# EAGLE design rgbww32c3wroom02 (EAGLE 7.7.0)
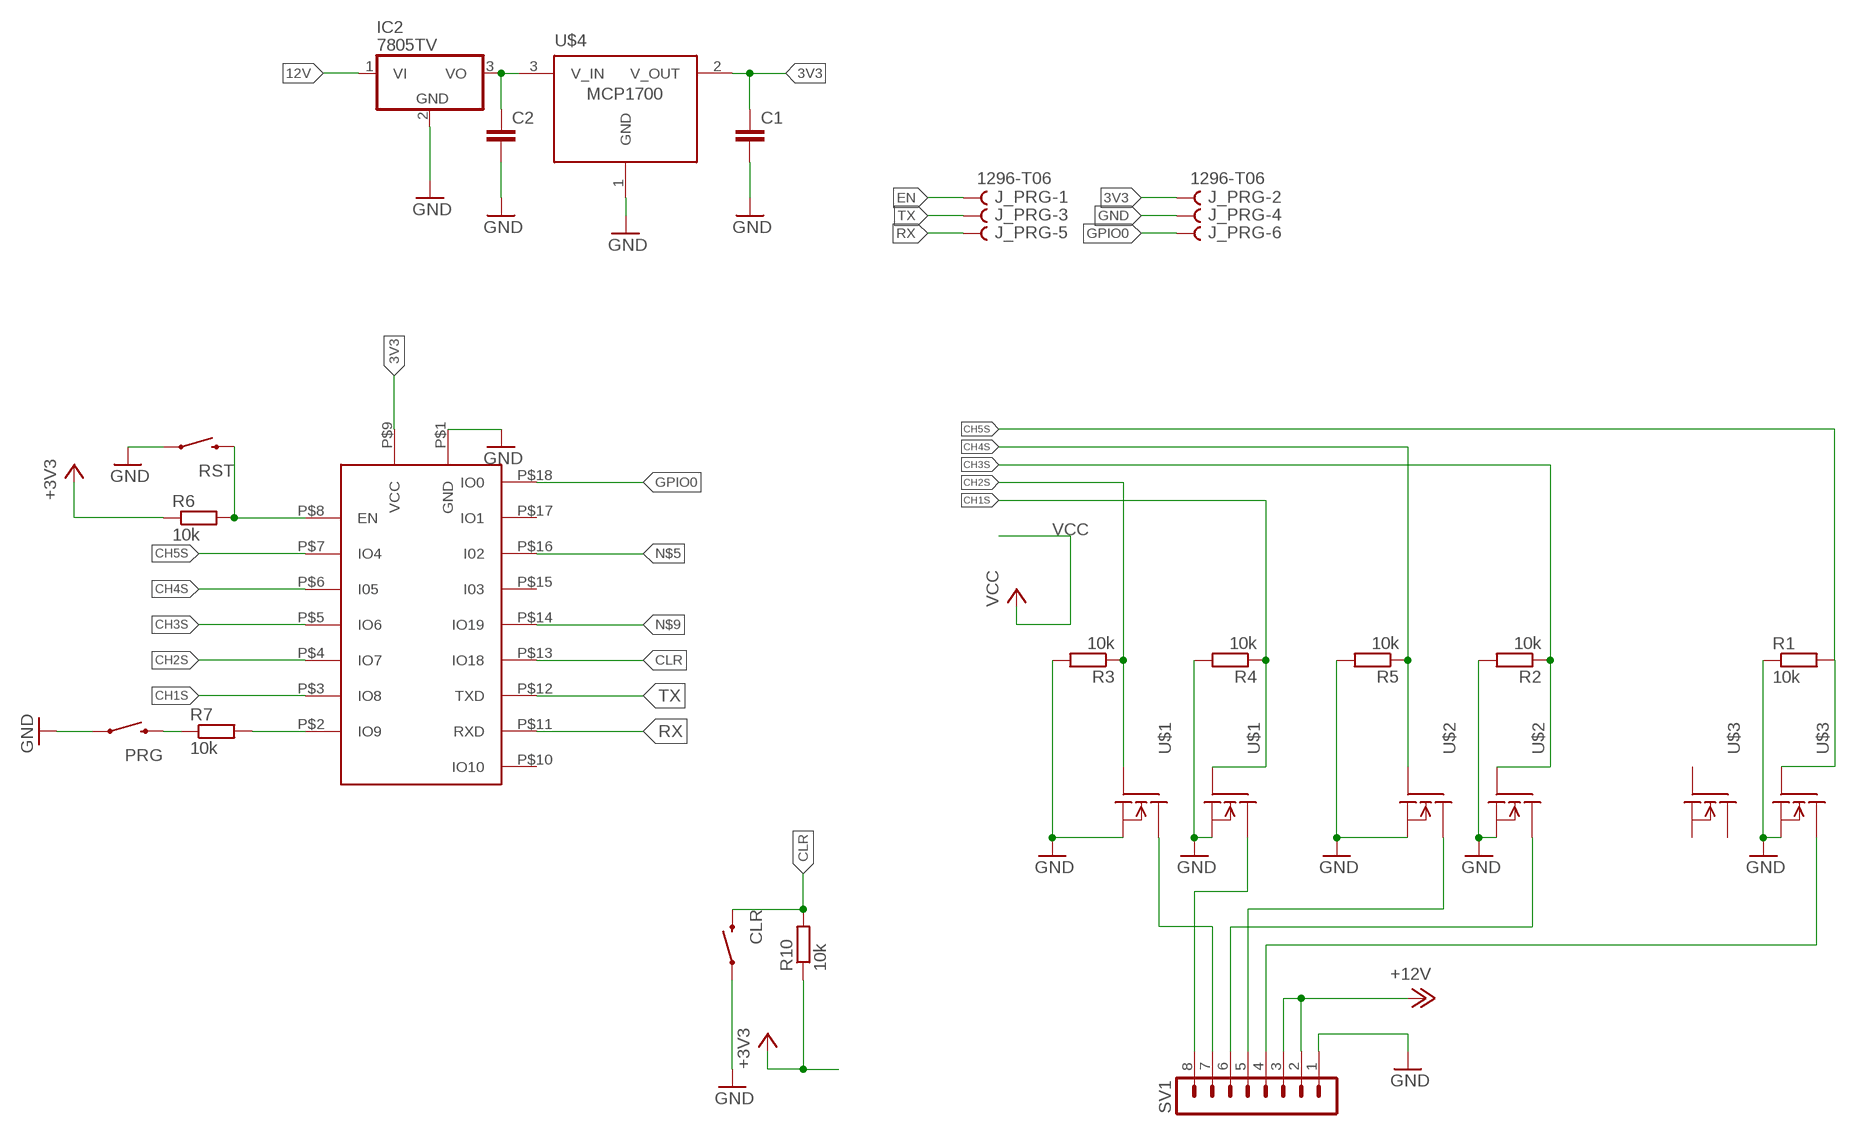
[diagram p0: schematic, sheet 1]

## Parts
C1  C-EUC1206  [C1206]
C2  C-EUC1206  [C1206]
CLR  SWITCH-MOMENTARY-2SMD-1101NE  [TACTILE-SWITCH-1101NE]
IC2  7805TV  [TO220V]
J_PRG  1296-T06  [06]
PRG  SWITCH-MOMENTARY-2SMD-1101NE  [TACTILE-SWITCH-1101NE]
R1  10k  R-EU_R0805  [R0805]
R2  10k  R-EU_R0805  [R0805]
R3  10k  R-EU_R0805  [R0805]
R4  10k  R-EU_R0805  [R0805]
R5  10k  R-EU_R0805  [R0805]
R6  10k  R-EU_R0805  [R0805]
R7  10k  R-EU_R0805  [R0805]
R10  10k  R-EU_R0805  [R0805]
RST  SWITCH-MOMENTARY-2SMD-1101NE  [TACTILE-SWITCH-1101NE]
SV1  MA08-1  [MA08-1]
U$1  AOD4806  [SO08]
U$2  AOD4806  [SO08]
U$3  AOD4806  [SO08]
U$4  MCP1700  MCP1700SOT23  [SOT-23]
U$5  ESP32C3WROOM02  [SMD]

## Nets
3V3: C1.1 J_PRG.2 R6.1 R10.1 U$4.2(V_OUT) U$5.P$9(VCC) ; supply symbol labelled +3V3
5V: C2.1 IC2.3(VO) U$4.3(V_IN)
12V: IC2.1(VI) SV1.2 SV1.3 ; supply symbol labelled +12V
CH1: SV1.8 U$1.5(D) U$1.6(D)
CH1S: R4.1 U$1.4(G) U$5.P$3(IO8)
CH2: SV1.7 U$1.7(D1) U$1.8(D1)
CH2S: R3.1 U$1.2(G1) U$5.P$4(IO7)
CH3: SV1.6 U$2.5(D) U$2.6(D)
CH3S: R2.1 U$2.4(G) U$5.P$5(IO6)
CH4: SV1.5 U$2.7(D1) U$2.8(D1)
CH4S: R5.1 U$2.2(G1) U$5.P$6(I05)
CH5: SV1.4 U$3.5(D) U$3.6(D)
CH5S: R1.2 U$3.4(G) U$5.P$7(IO4)
CLR: CLR.2 R10.2 U$5.P$13(IO18)
EN [Signal]: J_PRG.1 R6.2 RST.2 U$5.P$8(EN)
GND: C1.2 C2.2 CLR.1 IC2.2(GND) J_PRG.4 PRG.1 R1.1 R2.2 R3.2 R4.2 R5.2 RST.1 SV1.1 U$1.1(S1) U$1.3(S) U$2.1(S1) U$2.3(S) U$3.3(S) U$4.1(GND) U$5.P$1(GND)
GPIO0: J_PRG.6 U$5.P$18(IO0)
N$5: U$5.P$16(I02)
N$9: U$5.P$14(IO19)
PRG: R7.2 U$5.P$2(IO9)
PRG1: PRG.2 R7.1
RX: J_PRG.5 U$5.P$11(RXD)
TX: J_PRG.3 U$5.P$12(TXD)
Unconnected: U$3.1(S1) U$3.2(G1) U$3.7(D1) U$3.8(D1) U$5.P$10(IO10) U$5.P$15(I03) U$5.P$17(IO1)

## Library data of the parts
C1 C2 = rcl:C-EU: CAPACITOR, European symbol
CLR PRG RST = SparkFun-Electromechanical:SWITCH-MOMENTARY-2: Various NO switches- pushbuttons, reed, etc; PROD_ID: SWCH-00815
IC2 = linear:78*: Positive VOLTAGE REGULATOR Source: http://cache.national.com/ds/LM/LM78L05.pdf http://www.fairchildsemi.com/ds/LM/LM7805.pdf
J_PRG = con-leotronics:1296-T06: 1.27mm SINGLE ROW FEMALE SOCKET Source: http://www.leotronics.co.uk/Conexcon/Data%20Sheets/sec.%20A/1296ing.pdf
R1-R7 R10 = rcl:R-EU_: RESISTOR, European symbol
SV1 = con-lstb:MA08-1: PIN HEADER; OC_FARNELL: unknown; OC_NEWARK: unknown
U$1-U$3 = esp12_RGBWW:AOD4806
U$4 = MCP1700:MCP1700SOT23
U$5 = ESP32C3M:ESP32C3WROOM02: ESP32C3WROOM02 Module

## Net classes
5 Signal: width 0.381 mm

## Board
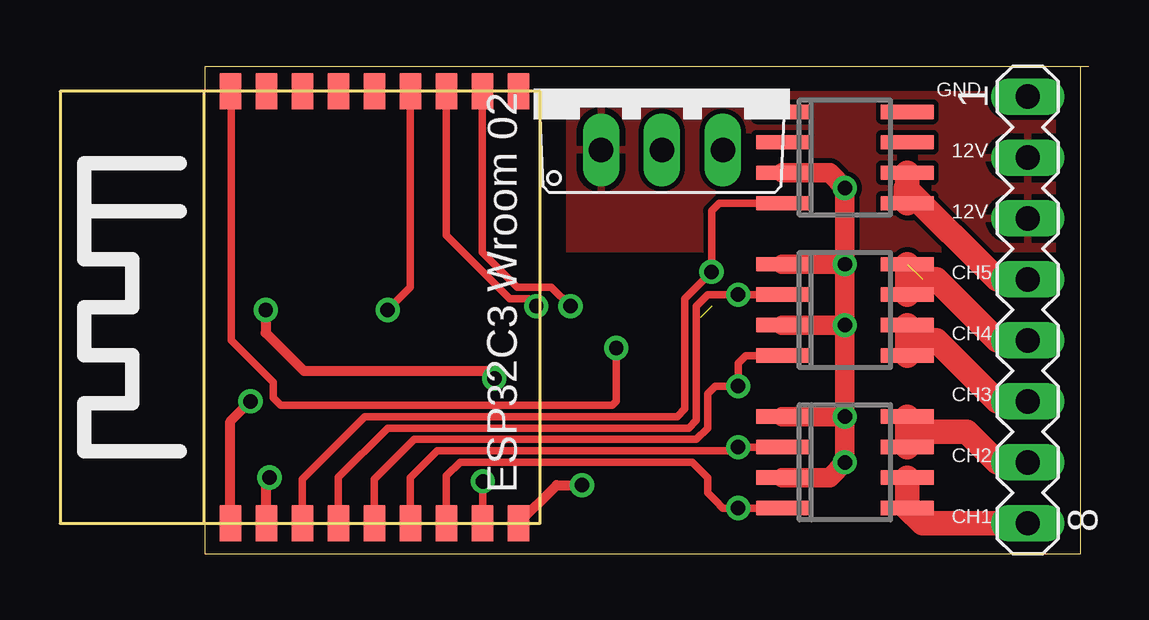
[diagram p1: board, top side]
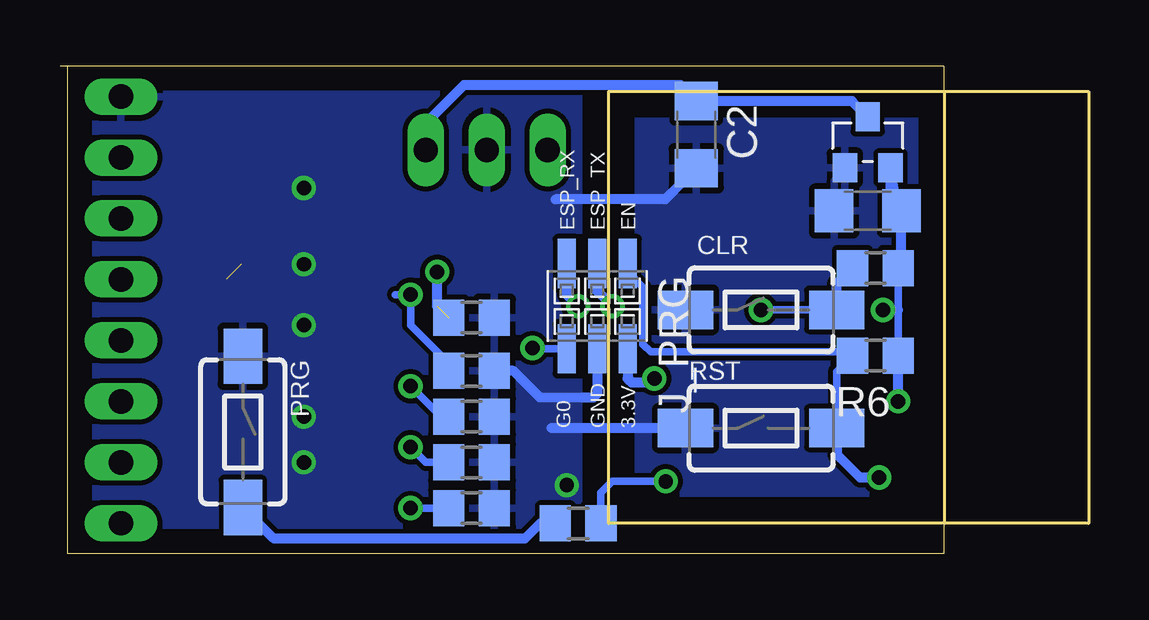
[diagram p2: board, bottom side, seen from below]

Size 42.86 x 20.32 mm. Coordinates in mm from the lower left corner, seen from the top.
Outline: 42.53,20.31 42.53,0 6.03,0 6.03,20.31
Outline: 6.04,20.32 42.86,20.32
Copper layers (1*16): Top 0.035mm / dielectric 1.5mm / Bottom 0.035mm
Design rules "default": minimum track width 10mil, minimum drill 24mil, track to track 8mil, track to pad 8mil, pad to pad 8mil, via to via 8mil, smd to smd 8mil, copper to edge 40mil, drill to drill 8mil, minimum pad ring 10mil, minimum via ring 8mil, stop-mask expansion 4mil, vias tented up to drill 0mil, thermal gap 10mil

### Footprints (pad centres in the part's own frame; a part is rotated, then mirrored left to right if it is on the bottom)
C1206 = smd 1.6 x 1.8: 1 -1.4,0; 2 1.4,0
TACTILE-SWITCH-1101NE = smd 2.3 x 1.6: 1 -3.15,0; 2 3.15,0
TO220V = drill 1.016 long: 1 -2.54,-2.54; 2 0,-2.54; 3 2.54,-2.54
06 = smd 0.76 x 2.05: 1 -1.27,-1.78; 2 -1.27,1.78; 3 0,-1.78; 4 0,1.78; 5 1.27,-1.78; 6 1.27,1.78
R0805 = smd 1.3 x 1.5: 1 -0.95,0; 2 0.95,0
MA08-1 = drill 1.016 long: 1 -8.89,0; 2 -6.35,0; 3 -3.81,0; 4 -1.27,0; 5 1.27,0; 6 3.81,0; 7 6.35,0; 8 8.89,0
SO08 = smd 0.6 x 2.2: 1 -1.905,-2.6; 2 -0.635,-2.6; 3 0.635,-2.6; 4 1.905,-2.6; 5 1.905,2.6; 6 0.635,2.6; 7 -0.635,2.6; 8 -1.905,2.6
SOT-23 = smd 1.016 x 1.2: 1 -0.95,-1.06; 2 0.95,-1.06; 3 0,1.06
SMD = smd 1.5 x 0.9: P$1 -8.89,-6.4; P$2 -8.89,-4.9; P$3 -8.89,-3.4; P$4 -8.89,-1.9; P$5 -8.89,-0.4; P$6 -8.89,1.1; P$7 -8.89,2.6; P$8 -8.89,4.1; P$9 -8.89,5.6; P$10 9.11,-6.4; P$11 9.11,-4.9; P$12 9.11,-3.4; P$13 9.11,-1.9; P$14 9.11,-0.4; P$15 9.11,1.1; P$16 9.11,2.6; P$17 9.11,4.1; P$18 9.11,5.6

### Placement (x,y rotation side)
C1  9.21,14.29 180 bottom
C2  16.35,17.46 270 bottom
CLR  13.65,10.16 0 bottom
IC2  25.08,19.37 0 top
J_PRG  20.48,10.32 180 bottom
PRG  35.24,5.08 270 bottom
R1  25.72,9.84 180 bottom
R2  25.72,5.72 0 bottom
R3  25.72,3.81 0 bottom
R4  25.72,1.91 0 bottom
R5  25.72,7.62 0 bottom
R6  8.89,8.25 180 bottom
R7  21.27,1.27 0 bottom
R10  8.89,11.91 180 bottom
RST  13.65,5.24 0 bottom
SV1  40.32,10.16 270 top
U$1  32.7,3.81 270 top
U$2  32.7,10.16 270 top
U$3  32.7,16.51 270 top
U$4  9.21,17.14 0 bottom
U$5  12.7,10.16 90 top

### Tracks (layer width: path | path; a pad name or v marks a point on that pad's centre or on a via)
3V3  (via drill 0.6)
  Top 0.406: U$5.P$9 7.1,5.51 v7.94,6.35 | v8.57,10.16 8.57,9.21 10.16,7.62 17.78,7.62 v18.1,7.3
  Bottom 0.305: 7.94,14.5 U$4.2 | R6.1 7.94,10.16 R10.1
  Bottom 0.406: R10.1 7.81,12.04 C1.1 | 7.81,14.37 8.26,14.81 U$4.2 | v7.94,6.35 R6.1 | v8.57,10.16 7.94,10.16 | J_PRG.2 19.21,7.3 19.05,7.14 18.26,7.14 v18.1,7.3
  Bottom 0.61: C1.1 7.81,14.37
5V
  Bottom 0.406: IC2.3 27.62,17.94 26.04,19.53 17.01,19.53 C2.1 9.87,18.86 U$4.3
12V
  pour Top: 18.73,20.32 42.86,20.32 42.86,12.7 18.73,12.7
CH1
  Top 1.016: SV1.8 35.94,1.27 U$1.5 U$1.6
CH1S  (via drill 0.6)
  Top 0.305: U$1.4 v28.26,1.91 27.62,1.91 27.31,2.22 26.99,2.54 26.99,3.18 26.35,3.81 16.67,3.81 16.1,3.24 U$5.P$3
  Bottom 0.305: v28.26,1.91 R4.1
CH2
  Top 1.016: SV1.7 39.05,3.81 37.78,5.08 35.94,5.08 U$1.8 U$1.7
CH2S  (via drill 0.6)
  Top 0.305: U$1.2 v28.26,4.45 28.1,4.29 15.72,4.29 14.6,3.17 U$5.P$4
  Bottom 0.305: v28.26,4.45 27.62,3.81 R3.1
CH3
  Top 1.016: SV1.6 39.05,6.35 36.51,8.89 35.94,8.89 U$2.5 U$2.6
CH3S  (via drill 0.6)
  Top 0.305: U$2.4 28.58,8.25 28.26,7.94 v28.26,6.98 27.31,6.98 26.99,6.67 26.99,5.24 26.51,4.76 14.76,4.76 13.1,3.1 U$5.P$5
  Bottom 0.305: R2.1 26.99,5.72 v28.26,6.98
CH4  (1 unrouted)
  Top 1.016: SV1.5 39.05,8.89 36.51,11.43 35.94,11.43 | U$2.7 U$2.8
CH4S  (via drill 0.6)
  Top 0.305: U$2.2 v28.26,10.8 26.99,10.8 26.51,10.32 26.51,5.56 26.19,5.24 13.65,5.24 11.6,3.19 U$5.P$6
  Top 0.406: 28.1,10.64 v28.26,10.8
  Bottom 0.305: 28.89,10.8 v28.26,10.8 28.26,9.53 26.67,7.94 R5.1
CH5
  Top 1.016: SV1.4 39.05,11.43 35.24,15.24 35.24,14.67 U$3.5 U$3.6
CH5S  (via drill 0.6)  (1 unrouted)
  Top 0.305: U$5.P$7 10.1,3.12 12.7,5.72 25.72,5.72 26.04,6.03 26.04,10.64 v27.15,11.75 27.15,14.29 27.46,14.61 U$3.4
  Bottom 0.406: 27.15,10.32 v27.15,11.75
CLR  (via drill 0.6)
  Top 0.305: U$5.P$13 14.6,11.11 v13.65,10.16
  Bottom 0.305: v13.65,10.16 CLR.2
  Bottom 0.406: CLR.2 10.5,11.24 R10.2
EN  (via drill 0.6)
  Top 0.406: U$5.P$8 8.6,3.04 v8.73,3.18
  Bottom 0.305: J_PRG.1 19.21,11.75 18.57,11.11 18.57,8.73 18.26,8.41 10,8.41 R6.2 10.5,7.59 RST.2
  Bottom 0.406: v8.73,3.18 9.53,3.18 10.48,4.13 10.48,5.21 RST.2
GND  (via drill 0.6)
  Top 0.406: U$5.P$1 20.69,2.86 v21.75,2.86
  Top 0.813: U$3.3 32.07,15.88 v32.7,15.24 v32.7,12.06 | U$1.3 32.07,3.18 v32.7,3.81 v32.7,5.72 | v32.7,5.72 v32.7,9.53 | v32.7,9.53 v32.7,12.06 | U$2.1 v32.7,12.06 | U$2.3 v32.7,9.53 | U$1.1 v32.7,5.72
  Bottom 0.406: J_PRG.4 20.48,6.67 20.64,6.51 22.86,6.51 23.97,7.62 R5.2 | C2.2 17.65,14.76 22.22,14.76 | RST.1 22.38,5.24
  pour Bottom: 6.03,20.32 42.86,20.32 42.86,0 6.03,0
GPIO0  (via drill 0.6)
  Top 0.305: U$5.P$18 7.14,19.23 7.14,8.89 8.89,7.14 8.89,6.51 9.21,6.19 23.02,6.19 23.18,6.35 v23.18,8.57
  Bottom 0.305: J_PRG.6 22.83,8.54 v23.18,8.57
PRG  (via drill 0.6)
  Top 0.305: v17.62,3.02 17.62,1.29 U$5.P$2
  Bottom 0.305: R7.2 20.32,2.54 19.84,3.02 v17.62,3.02
PRG1
  Bottom 0.406: PRG.2 33.95,0.64 23.49,0.64 22.86,1.27 R7.1
RX  (via drill 0.6)
  Top 0.305: U$5.P$11 17.6,12.56 19.05,11.11 20.48,11.11 v21.27,10.32
  Bottom 0.406: v21.27,10.32 21.75,10.8 J_PRG.5
TX  (via drill 0.6)
  Top 0.305: U$5.P$12 16.1,13.27 18.73,10.64 19.53,10.64 v19.84,10.32
  Bottom 0.406: v19.84,10.32 20.48,10.95 J_PRG.3

### Text on the board
tNames: GND | 12V | 12V | CH5 | CH4 | CH3 | CH2 | CH1
bNames: EN | ESP_TX | ESP_RX | 3.3V | GND | G0